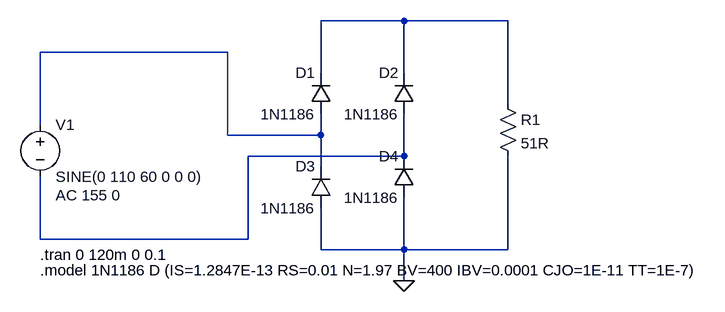
[diagram p0: schematic rectificador monofasico de onda completa.asc]
rectificador monofasico de onda completa.asc, the LTspice schematic file:
Version 4.1
SHEET 1 928 680
WIRE 384 -16 256 -16
WIRE 544 -16 384 -16
WIRE 112 32 -176 32
WIRE 256 64 256 -16
WIRE 384 64 384 -16
WIRE 544 112 544 -16
WIRE -176 144 -176 32
WIRE 112 160 112 32
WIRE 256 160 256 128
WIRE 256 160 112 160
WIRE 384 192 384 128
WIRE 384 192 144 192
WIRE 256 208 256 160
WIRE -176 320 -176 224
WIRE 144 320 144 192
WIRE 144 320 -176 320
WIRE 256 336 256 272
WIRE 384 336 384 256
WIRE 384 336 256 336
WIRE 544 336 544 192
WIRE 544 336 384 336
WIRE 384 384 384 336
FLAG 384 384 0
SYMBOL voltage -176 128 R0
WINDOW 123 24 124 Left 2
WINDOW 39 0 0 Left 0
SYMATTR Value2 AC 155 0
SYMATTR InstName V1
SYMATTR Value SINE(0 110 60 0 0 0)
SYMBOL diode 400 128 R180
WINDOW 0 24 64 Left 2
WINDOW 3 24 0 Left 2
SYMATTR InstName D2
SYMATTR Value 1N1186
SYMBOL diode 272 128 R180
WINDOW 0 24 64 Left 2
WINDOW 3 24 0 Left 2
SYMATTR InstName D1
SYMATTR Value 1N1186
SYMBOL diode 272 272 R180
WINDOW 0 24 64 Left 2
WINDOW 3 24 0 Left 2
SYMATTR InstName D3
SYMATTR Value 1N1186
SYMBOL diode 400 256 R180
WINDOW 0 24 64 Left 2
WINDOW 3 24 0 Left 2
SYMATTR InstName D4
SYMATTR Value 1N1186
SYMBOL res 528 96 R0
SYMATTR InstName R1
SYMATTR Value 51R
TEXT -176 344 Left 2 !.tran 0 120m 0 0.1
TEXT -176 368 Left 2 !.model 1N1186 D (IS=1.2847E-13 RS=0.01 N=1.97 BV=400 IBV=0.0001 CJO=1E-11 TT=1E-7)

The netlist it stands for:
* rectificador monofasico de onda completa.asc
V1 N002 N003 SINE(0 110 60 0 0 0) AC 155 0
D2 N003 N001 1N1186
D1 N002 N001 1N1186
D3 0 N002 1N1186
D4 0 N003 1N1186
R1 N001 0 51R
.model D D
.lib standard.dio
.tran 0 120m 0 0.1
.model 1N1186 D (IS=1.2847E-13 RS=0.01 N=1.97 BV=400 IBV=0.0001 CJO=1E-11 TT=1E-7)
.backanno
.end